# Altium project EEG_circuit.PrjPcb
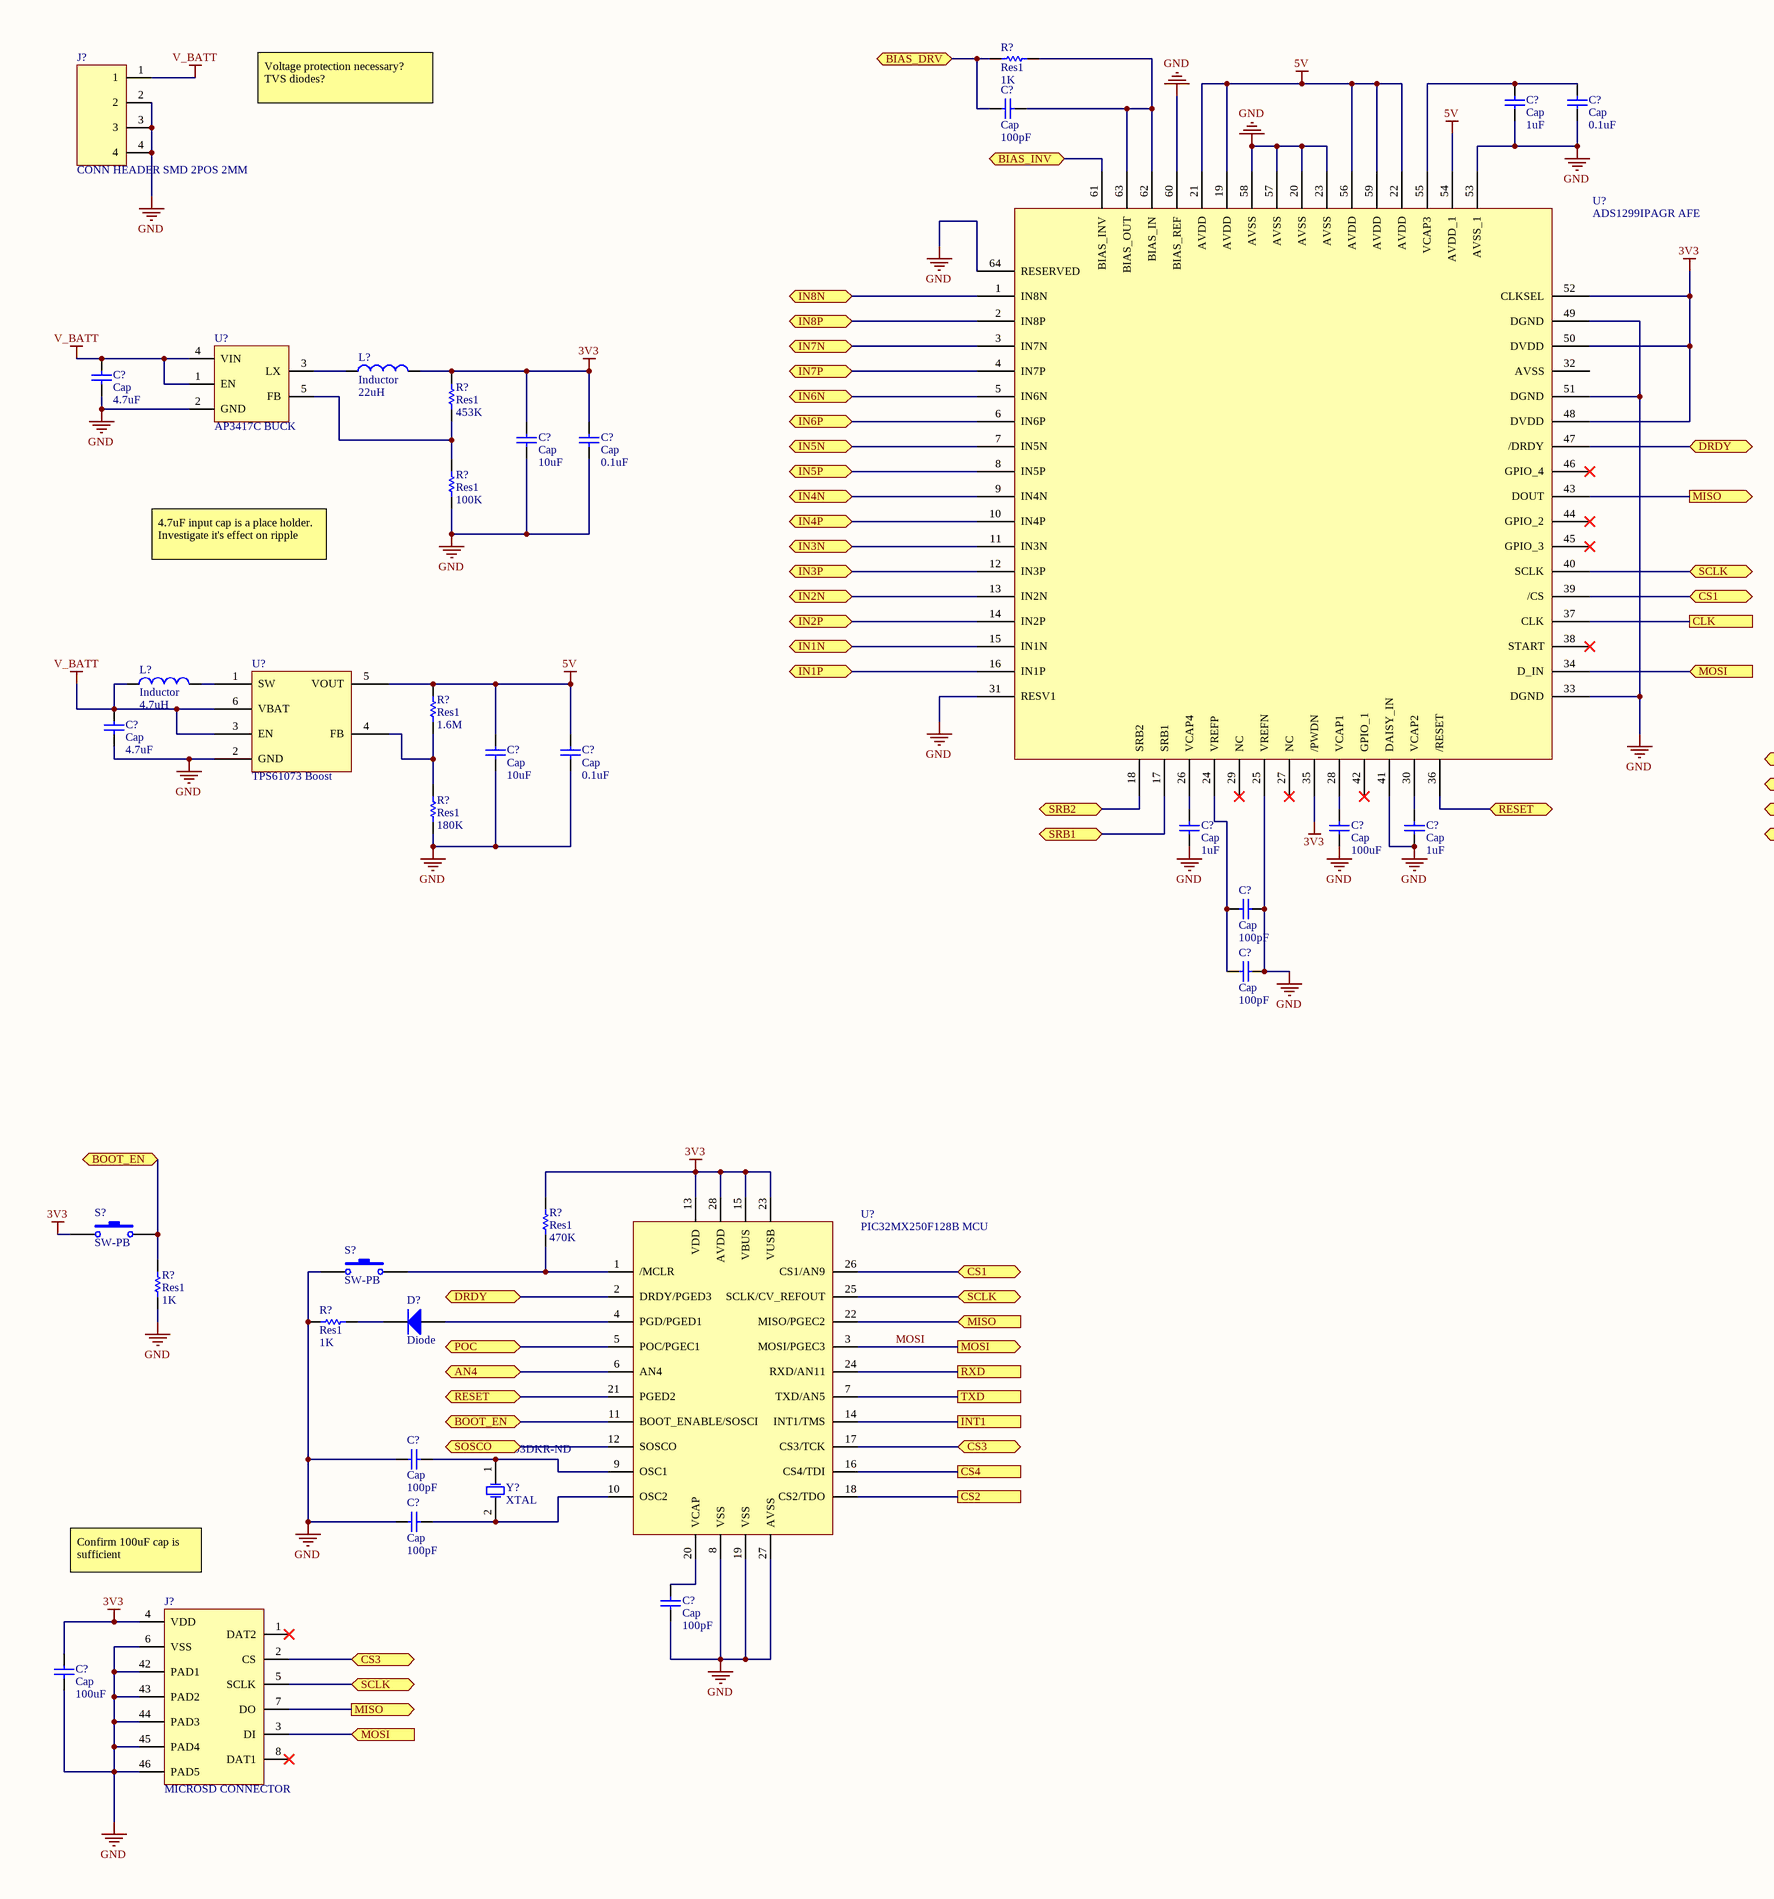
[diagram p0: EEG_schematic.SchDoc, left]
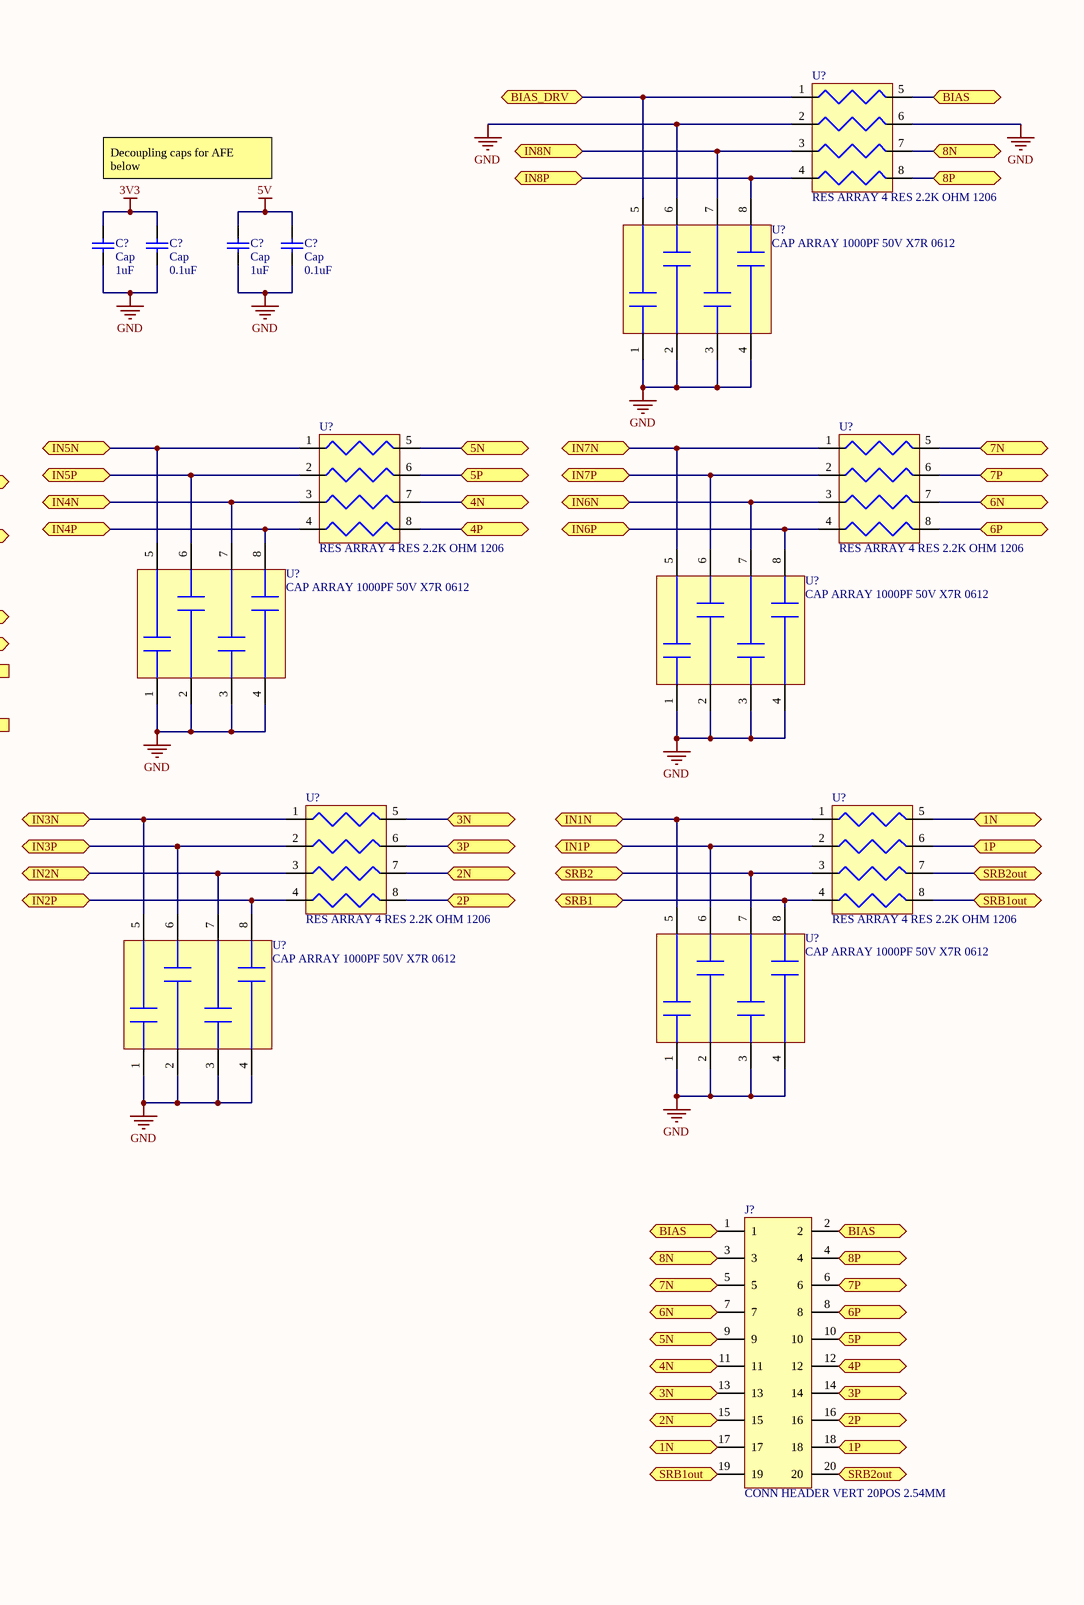
[diagram p1: EEG_schematic.SchDoc, right]
1 sheet, 53 parts. Net scope: flat (ports and power ports of the same name join across sheets).

## Sheet EEG_schematic.SchDoc
size A2

### Parts
(Parts that share a designator on the sheet are numbered #1, #2 ... from top to bottom, then left to right.)
C?#1  Cap  value 1uF  [RAD-0.3]
C?#2  Cap  value 0.1uF  [RAD-0.3]
C?#3  Cap  value 100pF  [RAD-0.3]
C?#4  Cap  value 1uF  [RAD-0.3]
C?#5  Cap  value 0.1uF  [RAD-0.3]
C?#6  Cap  value 1uF  [RAD-0.3]
C?#7  Cap  value 0.1uF  [RAD-0.3]
C?#8  Cap  value 4.7uF  [RAD-0.3]
C?#9  Cap  value 10uF  [RAD-0.3]
C?#10  Cap  value 0.1uF  [RAD-0.3]
C?#11  Cap  value 4.7uF  [RAD-0.3]
C?#12  Cap  value 10uF  [RAD-0.3]
C?#13  Cap  value 0.1uF  [RAD-0.3]
C?#14  Cap  value 1uF  [RAD-0.3]
C?#15  Cap  value 100uF  [RAD-0.3]
C?#16  Cap  value 1uF  [RAD-0.3]
C?#17  Cap  value 100pF  [RAD-0.3]
C?#18  Cap  value 100pF  [RAD-0.3]
C?#19  Cap  value 100pF  [RAD-0.3]
C?#20  Cap  value 100pF  [RAD-0.3]
C?#21  Cap  value 100pF  [RAD-0.3]
C?#22  Cap  value 100uF  [RAD-0.3]
D?  Diode  [SMC]
J?#1  CONN HEADER SMD 2POS 2MM
J?#2  CONN HEADER VERT 20POS 2.54MM
J?#3  MICROSD CONNECTOR
L?#1  Inductor  value 22uH  [0402-A]
L?#2  Inductor  value 4.7uH  [0402-A]
R?#1  Res1  value 1K  [AXIAL-0.3]
R?#2  Res1  value 453K
R?#3  Res1  value 100K
R?#4  Res1  value 1.6M
R?#5  Res1  value 180K
R?#6  Res1  value 470K  [AXIAL-0.3]
R?#7  Res1  value 1K  [AXIAL-0.3]
R?#8  Res1  value 1K  [AXIAL-0.3]
S?#1  SW-PB  [SPST-2]
S?#2  SW-PB  [SPST-2]
U?#1  RES ARRAY 4 RES 2.2K OHM 1206
U?#2  CAP ARRAY 1000PF 50V X7R 0612
U?#3  AP3417C BUCK
U?#4  RES ARRAY 4 RES 2.2K OHM 1206
U?#5  RES ARRAY 4 RES 2.2K OHM 1206
U?#6  ADS1299IPAGR AFE
U?#7  CAP ARRAY 1000PF 50V X7R 0612
U?#8  CAP ARRAY 1000PF 50V X7R 0612
U?#9  TPS61073 Boost
U?#10  RES ARRAY 4 RES 2.2K OHM 1206
U?#11  RES ARRAY 4 RES 2.2K OHM 1206
U?#12  CAP ARRAY 1000PF 50V X7R 0612
U?#13  CAP ARRAY 1000PF 50V X7R 0612
U?#14  PIC32MX250F128B MCU
Y?  XTAL  Supplier Part Number 1: XC2103DKR-ND

### Ports
1N (bidir), 1P (bidir), 2N (bidir), 2P (bidir), 3N (bidir), 3P (bidir), 4N (bidir), 4P (bidir), 5N (bidir), 5P (bidir), 6N (bidir), 6P (bidir), 7N (bidir), 7P (bidir), 8N (bidir), 8P (bidir), AN4 (bidir), BIAS (bidir), BIAS_DRV (bidir), BIAS_INV (bidir), BOOT_EN (bidir), CLK, CS1 (bidir), CS2, CS3 (bidir), CS4, DRDY (bidir), IN1N (bidir), IN1P (bidir), IN2N (bidir), IN2P (bidir), IN3N (bidir), IN3P (bidir), IN4N (bidir), IN4P (bidir), IN5N (bidir), IN5P (bidir), IN6N (bidir), IN6P (bidir), IN7N (bidir), IN7P (bidir), IN8N (bidir), IN8P (bidir), INT1, MISO (in), MISO (out), MOSI (in), MOSI (out), POC (bidir), RESET (bidir), RXD, SCLK (bidir), SOSCO (bidir), SRB1 (bidir), SRB1out (bidir), SRB2 (bidir), SRB2out (bidir), TXD

### Nets
3V3: C?#4.2 C?#5.2 C?#9.2 C?#10.2 C?#22.2 J?#3.4(VDD) L?#1.2 R?#2.2 R?#6.2 S?#1.1 U?#6.35(/PWDN) U?#6.48(DVDD) U?#6.50(DVDD) U?#6.52(CLKSEL) U?#14.13(VDD) U?#14.15(VBUS) U?#14.23(VUSB) U?#14.28(AVDD)
5V: C?#6.2 C?#7.2 C?#12.2 C?#13.2 R?#4.2 U?#6.19(AVDD) U?#6.21(AVDD) U?#6.22(AVDD) U?#6.54(AVDD_1) U?#6.56(AVDD) U?#6.59(AVDD) U?#9.5(VOUT)
GND: C?#1.1 C?#2.1 C?#4.1 C?#5.1 C?#6.1 C?#7.1 C?#8.1 C?#9.1 C?#10.1 C?#11.1 C?#12.1 C?#13.1 C?#14.1 C?#15.1 C?#16.1 C?#17.2 C?#18.2 C?#19.1 C?#20.1 C?#21.1 C?#22.1 J?#1.2 J?#1.3 J?#1.4 J?#3.6(VSS) J?#3.42(PAD1) J?#3.43(PAD2) J?#3.44(PAD3) J?#3.45(PAD4) J?#3.46(PAD5) R?#3.1 R?#5.1 R?#7.1 R?#8.1 S?#2.1 U?#1.2 U?#1.6 U?#2.1 U?#2.2 U?#2.3 U?#2.4 U?#2.6 U?#3.2(GND) U?#6.20(AVSS) U?#6.23(AVSS) U?#6.25(VREFN) U?#6.31(RESV1) U?#6.33(DGND) U?#6.41(DAISY_IN) U?#6.49(DGND) U?#6.51(DGND) U?#6.53(AVSS_1) U?#6.57(AVSS) U?#6.58(AVSS) U?#6.60(BIAS_REF) U?#6.64(RESERVED) U?#7.1 U?#7.2 U?#7.3 U?#7.4 U?#8.1 U?#8.2 U?#8.3 U?#8.4 U?#9.2(GND) U?#12.1 U?#12.2 U?#12.3 U?#12.4 U?#13.1 U?#13.2 U?#13.3 U?#13.4 U?#14.8(VSS) U?#14.19(VSS) U?#14.27(AVSS)
V_BATT: C?#8.2 C?#11.2 J?#1.1 L?#2.1 U?#3.1(EN) U?#3.4(VIN) U?#9.3(EN) U?#9.6(VBAT)
MOSI: J?#3.3(DI) U?#6.34(D_IN) U?#14.3(MOSI/PGEC3) ; port MOSI
NetC?#1_2: C?#1.2 C?#2.2 U?#6.55(VCAP3)
NetC?#3_1: C?#3.1 R?#1.2 U?#6.62(BIAS_IN) U?#6.63(BIAS_OUT)
NetC?#3_2: C?#3.2 R?#1.1 U?#1.1 U?#2.5 ; port BIAS_DRV
NetC?#14_2: C?#14.2 U?#6.26(VCAP4)
NetC?#15_2: C?#15.2 U?#6.28(VCAP1)
NetC?#16_2: C?#16.2 U?#6.30(VCAP2)
NetC?#17_1: C?#17.1 C?#18.1 U?#6.24(VREFP)
NetC?#19_2: C?#19.2 U?#14.9(OSC1) Y?.1(OSC1)
NetC?#20_2: C?#20.2 U?#14.10(OSC2) Y?.2(OSC2)
NetC?#21_2: C?#21.2 U?#14.20(VCAP)
NetD?_1: D?.1(A) U?#14.4(PGD/PGED1)
NetD?_2: D?.2(K) R?#8.2
NetJ?#2_1: J?#2.1 J?#2.2 U?#1.5 ; port BIAS
NetJ?#2_3: J?#2.3 U?#1.7 ; port 8N
NetJ?#2_4: J?#2.4 U?#1.8 ; port 8P
NetJ?#2_5: J?#2.5 U?#5.5 ; port 7N
NetJ?#2_6: J?#2.6 U?#5.6 ; port 7P
NetJ?#2_7: J?#2.7 U?#5.7 ; port 6N
NetJ?#2_8: J?#2.8 U?#5.8 ; port 6P
NetJ?#2_9: J?#2.9 U?#4.5 ; port 5N
NetJ?#2_10: J?#2.10 U?#4.6 ; port 5P
NetJ?#2_11: J?#2.11 U?#4.7 ; port 4N
NetJ?#2_12: J?#2.12 U?#4.8 ; port 4P
NetJ?#2_13: J?#2.13 U?#10.5 ; port 3N
NetJ?#2_14: J?#2.14 U?#10.6 ; port 3P
NetJ?#2_15: J?#2.15 U?#10.7 ; port 2N
NetJ?#2_16: J?#2.16 U?#10.8 ; port 2P
NetJ?#2_17: J?#2.17 U?#11.5 ; port 1N
NetJ?#2_18: J?#2.18 U?#11.6 ; port 1P
NetJ?#2_19: J?#2.19 U?#11.8 ; port SRB1out
NetJ?#2_20: J?#2.20 U?#11.7 ; port SRB2out
NetJ?#3_2: J?#3.2(CS) U?#14.17(CS3/TCK) ; port CS3
NetJ?#3_5: J?#3.5(SCLK) U?#6.40(SCLK) U?#14.25(SCLK/CV_REFOUT) ; port SCLK
NetJ?#3_7: J?#3.7(DO) U?#6.43(DOUT) U?#14.22(MISO/PGEC2) ; port MISO
NetL?#1_1: L?#1.1 U?#3.3(LX)
NetL?#2_2: L?#2.2 U?#9.1(SW)
NetR?#2_1: R?#2.1 R?#3.2 U?#3.5(FB)
NetR?#4_1: R?#4.1 R?#5.2 U?#9.4(FB)
NetR?#6_1: R?#6.1 S?#2.2 U?#14.1(/MCLR)
NetR?#7_2: R?#7.2 S?#1.2 U?#14.11(BOOT_ENABLE/SOSCI) ; port BOOT_EN
NetU?#1_3: U?#1.3 U?#2.7 U?#6.1(IN8N) ; port IN8N
NetU?#1_4: U?#1.4 U?#2.8 U?#6.2(IN8P) ; port IN8P
NetU?#4_1: U?#4.1 U?#6.7(IN5N) U?#7.5 ; port IN5N
NetU?#4_2: U?#4.2 U?#6.8(IN5P) U?#7.6 ; port IN5P
NetU?#4_3: U?#4.3 U?#6.9(IN4N) U?#7.7 ; port IN4N
NetU?#4_4: U?#4.4 U?#6.10(IN4P) U?#7.8 ; port IN4P
NetU?#5_1: U?#5.1 U?#6.3(IN7N) U?#8.5 ; port IN7N
NetU?#5_2: U?#5.2 U?#6.4(IN7P) U?#8.6 ; port IN7P
NetU?#5_3: U?#5.3 U?#6.5(IN6N) U?#8.7 ; port IN6N
NetU?#5_4: U?#5.4 U?#6.6(IN6P) U?#8.8 ; port IN6P
NetU?#6_11: U?#6.11(IN3N) U?#10.1 U?#13.5 ; port IN3N
NetU?#6_12: U?#6.12(IN3P) U?#10.2 U?#13.6 ; port IN3P
NetU?#6_13: U?#6.13(IN2N) U?#10.3 U?#13.7 ; port IN2N
NetU?#6_14: U?#6.14(IN2P) U?#10.4 U?#13.8 ; port IN2P
NetU?#6_15: U?#6.15(IN1N) U?#11.1 U?#12.5 ; port IN1N
NetU?#6_16: U?#6.16(IN1P) U?#11.2 U?#12.6 ; port IN1P
NetU?#6_17: U?#6.17(SRB1) U?#11.4 U?#12.8 ; port SRB1
NetU?#6_18: U?#6.18(SRB2) U?#11.3 U?#12.7 ; port SRB2
NetU?#6_36: U?#6.36(/RESET) U?#14.21(PGED2) ; port RESET
NetU?#6_37: U?#6.37(CLK) ; port CLK
NetU?#6_39: U?#6.39(/CS) U?#14.26(CS1/AN9) ; port CS1
NetU?#6_47: U?#6.47(/DRDY) U?#14.2(DRDY/PGED3) ; port DRDY
NetU?#6_61: U?#6.61(BIAS_INV) ; port BIAS_INV
NetU?#14_5: U?#14.5(POC/PGEC1) ; port POC
NetU?#14_6: U?#14.6(AN4) ; port AN4
NetU?#14_7: U?#14.7(TXD/AN5) ; port TXD
NetU?#14_12: U?#14.12(SOSCO) ; port SOSCO
NetU?#14_14: U?#14.14(INT1/TMS) ; port INT1
NetU?#14_16: U?#14.16(CS4/TDI) ; port CS4
NetU?#14_18: U?#14.18(CS2/TDO) ; port CS2
NetU?#14_24: U?#14.24(RXD/AN11) ; port RXD

Not connected (* = marked no-connect by the designer): J?#3 1(DAT2)* 8(DAT1)*; U?#6 27(NC)* 29(NC)* 32(AVSS) 38(START)* 42(GPIO_1)* 44(GPIO_2)* 45(GPIO_3)* 46(GPIO_4)*

### Notes on the sheet
- Voltage protection necessary? TVS diodes?
- Decoupling caps for AFE below
- 4.7uF input cap is a place holder. Investigate it's effect on ripple
- Confirm 100uF cap is sufficient

### Library data of the parts
C?#1-C?#22 = Cap: Capacitor; Published: 8-Jun-2000; LatestRevisionDate: 17-Jul-2002; LatestRevisionNote: Re-released for DXP Platform.; PackageReference: RAD-0.3; Publisher: Altium Limited; PackageDescription: Radial Cap, Thru-Hole; 2 Leads; 0.3 in Pin Spacing
D? = Diode: Default Diode; Published: 8-Jun-2000; LatestRevisionDate: 17-Jul-2002; LatestRevisionNote: Re-released for DXP Platform.; PackageVersion: Sep-1996; PackageReference: SMC; Publisher: Altium Limited; PackageDescription: DO-214-AB/SMC; 2 C-Bend Leads; Body 7.9 x 5.9 mm, inc. leads (LxW); Code_JEDEC: DO-214-AB
J?#1 = B2B-PH-SM4-TBT(LF)(SN): Manufacturer: JST; Number of Positions: 2; Connector Type: Male Pin; Pitch: 0.079inch; Supplier 1: Digi-Key; Manufacturer Part Number: B2B-PH-SM4-TBT(LF)(SN); Stock 1: 6672; Pricing 1: 1=0.82, 10=0.768, 100=0.5888, 500=0.51202 (USD); Mount: Surface Mount; Color: Natural; Contact Plating: Tin; Packaging: Cut Tape; Number of Rows: 1; Package Quantity: 1; Fastening Type: Detent; Termination: Solder; Contact Mating Length: 0.13inch; Lead Free: Lead Free; ComponentLink1URL: https://www.verical.com/server-webapp/html/getDatasheet?partID=473167&src-supplier=Verical; ComponentLink1Description: https://www.verical.com/server-webapp/html/getDatasheet?partID=473167&src-supplier=Verical; ComponentLink2URL: http://www.jst-mfg.com/product/pdf/eng/ePH.pdf?src-supplier=Digi-Key; ComponentLink2Description: http://www.jst-mfg.com/product/pdf/eng/ePH.pdf?src-supplier=Digi-Key; Supplier Part Number 1: 455-2872-6-ND
J?#2 = 61302021121: WURTH ELEKTRONIK         61302021121            Board-To-Board Connector, Vertical, WR-PHD Series, Through Hole, Header, 20 Contacts, 2.54 mm; Manufacturer: Wurth Electronics; Number of Positions: 20; Gender: Male; Connector Type: Male Pin; Pitch: 0.1inch; Supplier 1: Digi-Key; Manufacturer Part Number: 61302021121; Stock 1: 1836; Pricing 1: 1=1.31, 10=1.115, 25=0.9292, 50=0.774, 100=0.704, 500=0.64 (USD); Mount: Through Hole; Contact Plating: Gold; Contact Material: Copper; Color: Black; Number of Rows: 2; Packaging: Bulk; Termination: Solder; Number of Contacts: 20; Row Spacing: 0.1inch; Contact Mating Length: 0.236inch; REACH SVHC: Unknown; ComponentLink1URL: http://www.farnell.com/datasheets/1442180.pdf?src-supplier=Element14; ComponentLink1Description: http://www.farnell.com/datasheets/1442180.pdf?src-supplier=Element14; Supplier Part Number 1: 732-5301-ND
J?#3 = MEM2067-02-180-00-A: GLOBAL CONNECTOR TECHNOLOGY         MEM2067-02-180-00-A             MEMORY CARD CONNECTOR, 8 POSITION; Number of Contacts: 8; Supplier 1: Digi-Key; Manufacturer: Global Connector Technology; Manufacturer Part Number: MEM2067-02-180-00-A; Stock 1: 0; Mount: Socket; Contact Material: Copper Alloy; Contact Plating: Gold; REACH SVHC: No SVHC; Lead Free: Lead Free; ComponentLink1URL: http://www.farnell.com/datasheets/1876941.pdf?src-supplier=Element14; ComponentLink1Description: http://www.farnell.com/datasheets/1876941.pdf?src-supplier=Element14; ComponentLink2URL: http://www.farnell.com/datasheets/1876941.pdf?src-supplier=Farnell; ComponentLink2Description: http://www.farnell.com/datasheets/1876941.pdf?src-supplier=Farnell; Supplier Part Number 1: 2073-MEM2067-02-180-00-ACT-ND
L?#1 L?#2 = Inductor: Code_IEC: 1005; Published: 8-Jun-2000; LatestRevisionDate: 29-May-2009; LatestRevisionNote: IPC-7351 Footprint Added.; PackageReference: 0402-A; Publisher: Altium Limited; PackageDescription: Chip Inductor; Code_JEITA: 0402
R?#1 R?#6-R?#8 = Res1: Resistor; Published: 8-Jun-2000; LatestRevisionDate: 17-Jul-2002; LatestRevisionNote: Re-released for DXP Platform.; PackageReference: AXIAL-0.3; Publisher: Altium Limited; PackageDescription: Axial Device, Thru-Hole; 2 Leads; 0.3 in Pin Spacing
R?#2 = Res1: Resistor; Manufacturer: Yageo; Manufacturer Part Number: RC0402FR-07453KL; Description: Thick Film Resistors - SMD 453K OHM 1%; Resistance: 453kR; Tolerance: 1%; Power Rating: 62.5mW; Voltage Rating: 50V; Max Power Dissipation: 63mW; Temperature Coefficient: 100ppm/°C; Published: 8-Jun-2000; LatestRevisionDate: 17-Jul-2002; LatestRevisionNote: Re-released for DXP Platform.; PackageReference: AXIAL-0.3; Publisher: Altium Limited; PackageDescription: Axial Device, Thru-Hole; 2 Leads; 0.3 in Pin Spacing; Supplier 1: Digi-Key; Supplier Part Number 1: YAG3164DKR-ND; Stock 1: 786377; Pricing 1: 1=0.1, 10=0.016, 100=0.0064, 1000=0.00289, 2500=0.00251, 5000=0.00207 (USD); Case/Package: 0402; Case Code (Imperial): 0402; Case Code (Metric): 1005; Contact Plating: Tin,Matte; Min Operating Temperature: -55°C; Max Operating Temperature: 155°C; Packaging: Tape and Reel; Composition: Thick Film; Number of Terminations: 2; Termination: SMD/SMT; Military Standard: Not; Voltage Rating (DC): 50V; Features: Moisture Resistant; Length: 1mm; Height: 0.016inch; Width: 0.02inch; Depth: 0.5mm; Lead Free: Lead Free; ComponentLink1URL: http://www.yageo.com/documents/recent/PYu-RC0402_51_RoHS_L_6_r.pdf?src-supplier=Future+Electronics; ComponentLink1Description: http://www.yageo.com/documents/recent/PYu-RC0402_51_RoHS_L_6_r.pdf?src-supplier=Future+Electronics; ComponentLink2URL: https://www.verical.com/server-webapp/html/getDatasheet?partID=325135&src-supplier=Verical; ComponentLink2Description: https://www.verical.com/server-webapp/html/getDatasheet?partID=325135&src-supplier=Verical; ComponentLink3URL: http://www.yageo.com/documents/recent/PYu-RC0402_51_RoHS_L_6.pdf?src-supplier=Avnet; ComponentLink3Description: http://www.yageo.com/documents/recent/PYu-RC0402_51_RoHS_L_6.pdf?src-supplier=Avnet; ComponentLink4URL: http://www.yageo.com/documents/recent/PYu-RC0402_51_RoHS_L_6.pdf?src-supplier=Avnet+Europe; ComponentLink4Description: http://www.yageo.com/documents/recent/PYu-RC0402_51_RoHS_L_6.pdf?src-supplier=Avnet+Europe
R?#3 = Res1: Resistor; Manufacturer: Yageo; Manufacturer Part Number: RC0402FR-07100KL; Description: RES SMD 100K OHM 1% 1/16W 0402; Tolerance: 1%; Resistance: 100kR; Temperature Coefficient: 100ppm/°C; Power Rating: 63mW; Voltage Rating: 50V; Published: 8-Jun-2000; LatestRevisionDate: 17-Jul-2002; LatestRevisionNote: Re-released for DXP Platform.; PackageReference: AXIAL-0.3; Publisher: Altium Limited; PackageDescription: Axial Device, Thru-Hole; 2 Leads; 0.3 in Pin Spacing; Supplier 1: Digi-Key; Supplier Part Number 1: 311-100KLRDKR-ND; Stock 1: 56936694; Pricing 1: 1=0.1, 10=0.015, 100=0.006, 1000=0.0027, 2500=0.00235, 5000=0.00194 (USD); Case/Package: 0402; Case Code (Metric): 1005; Case Code (Imperial): 0402; Min Operating Temperature: -55°C; Max Operating Temperature: 155°C; Packaging: Tape and Reel; Composition: Thick Film; Termination: SMD/SMT; Military Standard: Not; Number of Terminations: 2; Working Voltage: 50V; Package Quantity: 1; Max Power Dissipation: 63mW; Features: Moisture Resistant; Length: 0.039inch; Height: 0.016inch; Width: 0.02inch; Depth: 0.5mm; REACH SVHC: No SVHC; Lead Free: Lead Free; ComponentLink1URL: http://www.yageo.com/documents/recent/PYu-RC_Group_51_RoHS_L_10.pdf?src-supplier=Digi-Key; ComponentLink1Description: http://www.yageo.com/documents/recent/PYu-RC_Group_51_RoHS_L_10.pdf?src-supplier=Digi-Key; ComponentLink2URL: http://www.farnell.com/datasheets/1018594.pdf?src-supplier=Element14; ComponentLink2Description: http://www.farnell.com/datasheets/1018594.pdf?src-supplier=Element14; ComponentLink3URL: http://www.yageo.com/documents/recent/PYu-RC_Group_51_RoHS_L_9.pdf?src-supplier=Verical; ComponentLink3Description: http://www.yageo.com/documents/recent/PYu-RC_Group_51_RoHS_L_9.pdf?src-supplier=Verical; ComponentLink4URL: http://www.yageo.com/documents/recent/PYu-RC_Group_51_RoHS_L_9.pdf?src-supplier=Mouser; ComponentLink4Description: http://www.yageo.com/documents/recent/PYu-RC_Group_51_RoHS_L_9.pdf?src-supplier=Mouser; ComponentLink5URL: http://documents.rs-components.com/techlib://itc_doclist_GB.htm?stockno=6185797&src-supplier=RSComponents; ComponentLink5Description: http://documents.rs-components.com/techlib://itc_doclist_GB.htm?stockno=6185797&src-supplier=RSComponents
R?#4 = Res1: Resistor; Manufacturer: Yageo; Manufacturer Part Number: RC0402JR-071M6L; Description: Res Thick Film 0402 1.6M Ohm 5% 0.063W(1/16W) ±100ppm/C Molded SMD Paper T/R; Resistance: 1.6MR; Tolerance: 5%; Max Power Dissipation: 63mW; Temperature Coefficient: 100ppm/°C; Published: 8-Jun-2000; LatestRevisionDate: 17-Jul-2002; LatestRevisionNote: Re-released for DXP Platform.; PackageReference: AXIAL-0.3; Publisher: Altium Limited; PackageDescription: Axial Device, Thru-Hole; 2 Leads; 0.3 in Pin Spacing; Supplier 1: Digi-Key; Supplier Part Number 1: YAG3284DKR-ND; Stock 1: 21969; Pricing 1: 1=0.1, 10=0.013, 100=0.0053, 1000=0.00236, 2500=0.00205, 5000=0.00169 (USD); Case/Package: 0402; Case Code (Metric): 1005; Case Code (Imperial): 0402; Contact Plating: Tin,Matte; Min Operating Temperature: -55°C; Max Operating Temperature: 155°C; Packaging: Tape and Reel; Composition: Thick Film; Number of Terminations: 2; Military Standard: Not; Features: Moisture Resistant; Length: 0.039inch; Height: 0.016inch; Width: 0.02inch; Depth: 0.5mm; Radiation Hardening: No; ComponentLink1URL: http://www.yageo.com/documents/recent/PYu-RC0402_51_RoHS_L_6.pdf?src-supplier=Avnet; ComponentLink1Description: http://www.yageo.com/documents/recent/PYu-RC0402_51_RoHS_L_6.pdf?src-supplier=Avnet; ComponentLink2URL: http://www.yageo.com/documents/recent/PYu-RC0402_51_RoHS_L_6.pdf?src-supplier=Avnet+Europe; ComponentLink2Description: http://www.yageo.com/documents/recent/PYu-RC0402_51_RoHS_L_6.pdf?src-supplier=Avnet+Europe
R?#5 = Res1: Resistor; Manufacturer: Yageo; Manufacturer Part Number: RC0402JR-07180KL; Description: RES SMD 180K OHM 5% 1/16W 0402; Resistance: 180kR; Tolerance: 5%; Power Rating: 63mW; Voltage Rating: 50V; Temperature Coefficient: 100ppm/°C; Published: 8-Jun-2000; LatestRevisionDate: 17-Jul-2002; LatestRevisionNote: Re-released for DXP Platform.; PackageReference: AXIAL-0.3; Publisher: Altium Limited; PackageDescription: Axial Device, Thru-Hole; 2 Leads; 0.3 in Pin Spacing; Supplier 1: Digi-Key; Supplier Part Number 1: 311-180KJRDKR-ND; Stock 1: 249583; Pricing 1: 1=0.1, 10=0.013, 100=0.0053, 1000=0.00236, 2500=0.00205, 5000=0.00169 (USD); Case/Package: 0402; Number of Pins: 2; Case Code (Imperial): 0402; Case Code (Metric): 1005; Min Operating Temperature: -55°C; Max Operating Temperature: 155°C; Voltage Rating (DC): 50V; Packaging: Tape and Reel; Package Quantity: 1; Termination: SMD/SMT; Composition: Thick Film; Number of Terminations: 2; Military Standard: Not; Max Power Dissipation: 63mW; Features: Moisture Resistant; Length: 1mm; Height: 0.016inch; Width: 0.5mm; Depth: 0.5mm; REACH SVHC: Unknown; Lead Free: Lead Free; ComponentLink1URL: http://www.farnell.com/datasheets/1018594.pdf?src-supplier=Farnell; ComponentLink1Description: http://www.farnell.com/datasheets/1018594.pdf?src-supplier=Farnell; ComponentLink2URL: http://www.yageo.com/documents/recent/PYu-RC0402_51_RoHS_L_6_r.pdf?src-supplier=Future+Electronics; ComponentLink2Description: http://www.yageo.com/documents/recent/PYu-RC0402_51_RoHS_L_6_r.pdf?src-supplier=Future+Electronics; ComponentLink3URL: http://www.farnell.com/datasheets/1018594.pdf?src-supplier=Element14; ComponentLink3Description: http://www.farnell.com/datasheets/1018594.pdf?src-supplier=Element14; ComponentLink4URL: http://www.yageo.com/documents/recent/PYu-RC_Group_51_RoHS_L_9.pdf?src-supplier=Digi-Key; ComponentLink4Description: http://www.yageo.com/documents/recent/PYu-RC_Group_51_RoHS_L_9.pdf?src-supplier=Digi-Key; ComponentLink5URL: http://www.yageo.com.tw/exep/pages/download/literatures/PYu-R_INT-thick_7.pdf?src-supplier=Digi-Key; ComponentLink5Description: http://www.yageo.com.tw/exep/pages/download/literatures/PYu-R_INT-thick_7.pdf?src-supplier=Digi-Key
S?#1 S?#2 = SW-PB: Switch; Published: 24-Mar-1999; LatestRevisionDate: 17-Jul-2002; LatestRevisionNote: Re-released for DXP Platform.; PackageReference: SPST-2; Publisher: Altium Limited; PackageDescription: Switch; 2 Leads
U?#1 U?#4 U?#5 U?#10 U?#11 = CAY16-2201F4LF: BOURNS         CAY16-2201F4LF             RESISTOR, ARRAY-4, 2.2KOHM, 5%, SMD; Resistance: 2.2kR; Tolerance: 1%; Power Rating: 248mW; Voltage Rating: 50V; Number of Elements: 4; Circuit Type: Isolated; Power Per Element: 62.5mW; Temperature Coefficient: 200ppm/°C; Supplier 1: Digi-Key; Manufacturer: Bourns; Manufacturer Part Number: CAY16-2201F4LF; Stock 1: 16204; Pricing 1: 1=0.14, 10=0.121, 25=0.088, 50=0.0638, 100=0.0473, 250=0.03632, 500=0.0286, 1000=0.0198 (USD); Mount: Surface Mount; Case/Package: 1206; Number of Pins: 8; Case Code (Metric): 3216; Case Code (Imperial): 1206; Number of Terminals: 8; Contact Plating: Tin; Min Operating Temperature: -55°C; Max Operating Temperature: 125°C; Packaging: Tape and Reel; Package Quantity: 1; Number of Resistors: 4; Termination: Convex; Military Standard: Not; Voltage Rating (DC): 50V; Number of Circuits: 4; Length: 3.2mm; Height: 0.024inch; Width: 0.063inch; Lead Pitch: 0.8mm; Terminal Pitch: 0.8mm; Depth: 1.6mm; REACH SVHC: No SVHC; Lead Free: Lead Free; ComponentLink1URL: http://uk.rs-online.com/webdocs/064e/0900766b8064e462.pdf?src-supplier=RSComponents; ComponentLink1Description: http://uk.rs-online.com/webdocs/064e/0900766b8064e462.pdf?src-supplier=RSComponents; ComponentLink2URL: http://www.bourns.com/pdfs/CATCAY.pdf?src-supplier=Avnet+Europe; ComponentLink2Description: http://www.bourns.com/pdfs/CATCAY.pdf?src-supplier=Avnet+Europe; ComponentLink3URL: http://www.bourns.com/docs/Product-Datasheets/CATCAY.pdf?src-supplier=Digi-Key; ComponentLink3Description: http://www.bourns.com/docs/Product-Datasheets/CATCAY.pdf?src-supplier=Digi-Key; ComponentLink4URL: http://www.bourns.com/pdfs/CATCAY.pdf?src-supplier=Avnet; ComponentLink4Description: http://www.bourns.com/pdfs/CATCAY.pdf?src-supplier=Avnet; ComponentLink5URL: http://www.farnell.com/datasheets/1849489.pdf?src-supplier=Element14; ComponentLink5Description: http://www.farnell.com/datasheets/1849489.pdf?src-supplier=Element14; ComponentLink6URL: https://www.bourns.com/docs/Product-Datasheets/CATCAY.pdf?src-supplier=Digi-Key; ComponentLink6Description: https://www.bourns.com/docs/Product-Datasheets/CATCAY.pdf?src-supplier=Digi-Key; ComponentLink7URL: http://www.produktinfo.conrad.com/datenblaetter/1000000-1099999/001055385-da-01-en-WID_ARR_CAY16_2201F4LF_2_2K_OHM_4_W_1206.pdf?src-supplier=Conrad; ComponentLink7Description: http://www.produktinfo.conrad.com/datenblaetter/1000000-1099999/001055385-da-01-en-WID_ARR_CAY16_2201F4LF_2_2K_OHM_4_W_1206.pdf?src-supplier=Conrad; Supplier Part Number 1: CAY16-2201F4LFDKR-ND
U?#2 U?#7 U?#8 U?#12 U?#13 = CA0612KRX7R9BB102: YAGEO (PHYCOMP)         CA0612KRX7R9BB102             Capacitor Array, C-Array, 1000 pF, 50 V,  10%, SMD, 4 Element; Dielectric Material: Ceramic; Capacitance: 1nF; Number of Elements: 4; Circuit Type: Isolated; Dissipation Factor: 2.5%; Insulation Resistance: 10GR; Supplier 1: Digi-Key; Manufacturer: Yageo; Manufacturer Part Number: CA0612KRX7R9BB102; Stock 1: 2369; Pricing 1: 1=0.41, 10=0.283, 100=0.1697, 500=0.12728, 1000=0.10749 (USD); Mount: Surface Mount; Case/Package: 0612; Case Code (Metric): 1632; Case Code (Imperial): 0612; Number of Terminals: 8; Min Operating Temperature: -55°C; Max Operating Temperature: 125°C; Tolerance: 10%; Voltage Rating: 50V; Packaging: Tape and Reel; Package Quantity: 4000; Dielectric: X7R; Number of Capacitors: 4; Termination: SMD/SMT; Composition: Ceramic; Voltage: 50V; Length: 3.2mm; Height: 0.8mm; Width: 0.063inch; Height - Seated (Max): 0.035inch; Terminal Pitch: 0.8mm; Depth: 3.2mm; Radiation Hardening: No; REACH SVHC: Unknown; Lead Free: Lead Free; ComponentLink1URL: https://www.verical.com/server-webapp/html/getDatasheet?partID=403419&src-supplier=Verical; ComponentLink1Description: https://www.verical.com/server-webapp/html/getDatasheet?partID=403419&src-supplier=Verical; ComponentLink2URL: http://www.yageo.com/documents/recent/UPY-4C-Array_16V-to-50V-3.pdf?src-supplier=Digi-Key; ComponentLink2Description: http://www.yageo.com/documents/recent/UPY-4C-Array_16V-to-50V-3.pdf?src-supplier=Digi-Key; ComponentLink3URL: http://www.farnell.com/datasheets/2167451.pdf?src-supplier=Element14; ComponentLink3Description: http://www.farnell.com/datasheets/2167451.pdf?src-supplier=Element14; ComponentLink4URL: http://www.yageo.com/documents/recent/UPY-4C-Array_16V-to-50V_4.pdf?src-supplier=Future+Electronics; ComponentLink4Description: http://www.yageo.com/documents/recent/UPY-4C-Array_16V-to-50V_4.pdf?src-supplier=Future+Electronics; Supplier Part Number 1: 311-2073-6-ND
U?#3 = AP3417CKTR-G1: IC REG BUCK ADJ 1A SYNC SOT25; Manufacturer: Diodes; Number of Outputs: 1; Min Input Voltage: 2.5V; Max Input Voltage: 5.5V; Efficiency: 94%; Min Output Voltage: 600mV; Max Output Voltage: 4.95V; Switching Frequency: 1.5MHz; Synchronous Rectifier: Yes; Output Voltage: 5V; Operating Supply Current: 220uA; Output Type: Adjustable; Output Configuration: Positive; Supplier 1: Digi-Key; Manufacturer Part Number: AP3417CKTR-G1; Stock 1: 30373; Pricing 1: 1=0.41, 10=0.351, 100=0.2621, 500=0.20592, 1000=0.15912 (USD); Mount: Surface Mount; Case/Package: SOT-23-5; Number of Pins: 5; Weight: 0.001058oz; Min Operating Temperature: -40°C; Max Operating Temperature: 85°C; Package Quantity: 3000; Packaging: Tape and Reel; Max Output Current: 1A; Output Current: 1A; Min Supply Voltage: 2.5V; Operating Supply Voltage: 5.5V; Length: 3.1mm; Height: 1.3mm; Width: 1.7mm; Lead Free: Lead Free; ComponentLink1URL: https://www.diodes.com/assets/Datasheets/AP3417C.pdf?src-supplier=Digi-Key; ComponentLink1Description: https://www.diodes.com/assets/Datasheets/AP3417C.pdf?src-supplier=Digi-Key; ComponentLink2URL: http://www.diodes.com/datasheets/AP3417C.pdf?src-supplier=Avnet; ComponentLink2Description: http://www.diodes.com/datasheets/AP3417C.pdf?src-supplier=Avnet; Supplier Part Number 1: AP3417CKTR-G1DIDKR-ND
U?#6 = ADS1299IPAGR: IC AFE 24BIT 16KSPS LN 64TQFP; Manufacturer: Texas Instruments; Max Supply Voltage: 5.25V; Max Power Dissipation: 42mW; Interface: SPI; Number of Bits: 24; Number of Channels: 8; Resolution: 24b; Sampling Rate: 16KS/s; Operating Supply Current: 7.14mA; Signal to Noise Ratio (SNR): 121dB; Power Consumption: 41mW; Supplier 1: Digi-Key; Manufacturer Part Number: ADS1299IPAGR; Stock 1: 1589; Pricing 1: 1=53.84, 10=50.577, 100=44.051 (USD); Case/Package: TQFP; Number of Pins: 64; Contact Plating: Gold; Min Operating Temperature: -40°C; Max Operating Temperature: 85°C; Package Quantity: 1; Packaging: Tape and Reel; Number of Converters: 8; Conversion Rate: 16KS/s; Number of Inputs: 8; Number of A/D Converters: 8; Type: General Purpose; Radiation Hardening: No; Lead Free: Lead Free; ComponentLink1URL: http://www.ti.com/lit/ds/symlink/ads1299.pdf?src-supplier=Digi-Key; ComponentLink1Description: http://www.ti.com/lit/ds/symlink/ads1299.pdf?src-supplier=Digi-Key; ComponentLink2URL: http://www.ti.com/general/docs/lit/getliterature.tsp?genericPartNumber=ADS1299&&fileType=pdf&src-supplier=Avnet; ComponentLink2Description: http://www.ti.com/general/docs/lit/getliterature.tsp?genericPartNumber=ADS1299&&fileType=pdf&src-supplier=Avnet; ComponentLink3URL: https://www.verical.com/server-webapp/html/getDatasheet?partID=681922&src-supplier=Verical; ComponentLink3Description: https://www.verical.com/server-webapp/html/getDatasheet?partID=681922&src-supplier=Verical; ComponentLink4URL: http://www.ti.com/litv/sbas499a?src-supplier=Mouser; ComponentLink4Description: http://www.ti.com/litv/sbas499a?src-supplier=Mouser; ComponentLink5URL: http://www.produktinfo.conrad.com/datenblaetter/1100000-1199999/001186463-da-01-en-IC_AFE_24BIT_16_ADS1299IPAGR_TQFP_64_TID.pdf?src-supplier=Conrad; ComponentLink5Description: http://www.produktinfo.conrad.com/datenblaetter/1100000-1199999/001186463-da-01-en-IC_AFE_24BIT_16_ADS1299IPAGR_TQFP_64_TID.pdf?src-supplier=Conrad; Supplier Part Number 1: 296-34818-6-ND; Category: Data Acquisition - Analog Front End (AFE)
U?#9 = TPS61073DDCR: IC REG BOOST ADJ 0.5A SYNC SOT6; Manufacturer: Texas Instruments; Output Voltage: 5.5V; Number of Outputs: 1; Max Output Current: 150mA; Min Input Voltage: 900mV; Efficiency: 90%; Frequency: 1.2MHz; Min Supply Voltage: 2.3V; Synchronous Rectifier: Yes; Quiescent Current: 19uA; Output Type: Adjustable; Output Configuration: Positive; Supplier 1: Digi-Key; Manufacturer Part Number: TPS61073DDCR; Stock 1: 6000; Pricing 1: 3000=0.52668, 6000=0.50688, 15000=0.49104 (USD); Mount: Surface Mount; Case/Package: SOT-23-6; Number of Pins: 6; Weight: 0.00127oz; Min Operating Temperature: -40°C; Max Operating Temperature: 85°C; Packaging: Tape and Reel; Max Input Voltage: 5.5V; Output Current: 150mA; Max Supply Voltage: 5.5V; Package Quantity: 1; Switching Frequency: 1.2MHz; Min Output Voltage: 2.3V; Max Output Voltage: 5.5V; Termination: SMD/SMT; Topology: Boost; REACH SVHC: No SVHC; Lead Free: Lead Free; ComponentLink1URL: http://focus.ti.com/lit/ds/symlink/tps61070.pdf?src-supplier=Element14; ComponentLink1Description: http://focus.ti.com/lit/ds/symlink/tps61070.pdf?src-supplier=Element14; ComponentLink2URL: http://www.ti.com/lit/ds/symlink/tps61073.pdf?src-supplier=Digi-Key; ComponentLink2Description: http://www.ti.com/lit/ds/symlink/tps61073.pdf?src-supplier=Digi-Key; Supplier Part Number 1: 296-21898-2-ND; Category: PMIC - Voltage Regulators - DC DC Switching Regulators
U?#14 = PIC32MX250F128B-I/SS: MICROCHIP - PIC32MX250F128B-I/SS - MCU, 32BIT, PIC32, 40MHZ, SSOP-28; Number of Timers/Counters: 5; Number of ADC Channels: 10; RAM Size: 32KB; Interface: I2C,SPI,USB,IrDA,UART,USART,LIN,I2S; Number of I/Os: 19; Max Supply Voltage: 3.6V; Min Supply Voltage: 2.3V; Number of UART Channels: 2; Data Bus Width: 32b; Oscillator Type: Internal; Watchdog Timer: Yes; Memory Type: FLASH; Memory Size: 128KB; Peripherals: I2C,Brown-out Detect/Reset,POR,PWM,WDT,DMA; Core Architecture: PIC; Supplier 1: Digi-Key; Manufacturer: Microchip; Manufacturer Part Number: PIC32MX250F128B-I/SS; Stock 1: 861; Pricing 1: 1=3.57, 25=3.27, 100=2.96 (USD); Case/Package: SSOP; Number of Pins: 28; Min Operating Temperature: -40°C; Max Operating Temperature: 85°C; Packaging: Rail/Tube; Package Quantity: 47; Frequency: 40MHz; Number of PWM Channels: 5; Number of Programmable I/O: 19; Max Frequency: 40MHz; Number of SPI Channels: 2; Number of I2C Channels: 2; Address Bus Width: 32b; Length: 10.5mm; Height: 1.85mm; Width: 5.6mm; Radiation Hardening: No; REACH SVHC: No SVHC; Lead Free: Lead Free; ComponentLink1URL: https://www.distrelec.biz/Web/Downloads/_t/ds/PIC32MX1XX_2XX_eng_tds.pdf?mime=application%2Fpdf&src-supplier=Distrelec; ComponentLink1Description: https://www.distrelec.biz/Web/Downloads/_t/ds/PIC32MX1XX_2XX_eng_tds.pdf?mime=application%2Fpdf&src-supplier=Distrelec; ComponentLink2URL: http://uk.rs-online.com/webdocs/1385/0900766b8138557c.pdf?src-supplier=RSComponents; ComponentLink2Description: http://uk.rs-online.com/webdocs/1385/0900766b8138557c.pdf?src-supplier=RSComponents; ComponentLink3URL: http://www.microchip.com/mymicrochip/filehandler.aspx?ddocname=en556114&src-supplier=Digi-Key; ComponentLink3Description: http://www.microchip.com/mymicrochip/filehandler.aspx?ddocname=en556114&src-supplier=Digi-Key; ComponentLink4URL: http://ww1.microchip.com/downloads/en/DeviceDoc/61168D.pdf?src-supplier=Avnet; ComponentLink4Description: http://ww1.microchip.com/downloads/en/DeviceDoc/61168D.pdf?src-supplier=Avnet; ComponentLink5URL: http://www.farnell.com/datasheets/1538023.pdf?src-supplier=Element14; ComponentLink5Description: http://www.farnell.com/datasheets/1538023.pdf?src-supplier=Element14; Supplier Part Number 1: PIC32MX250F128B-I/SS-ND
Y? = XTAL: Crystal Oscillator; Manufacturer: ECS International; Manufacturer Part Number: ECS-80-18-30-JGN-TR; Description: CRYSTAL 8.000 MHZ 18PF SMD; Frequency: 8MHz; Load Capacitance: 18pF; ESR (Equivalent Series Resistance): 100R; Frequency Stability: 30ppm; Frequency Tolerance: 20ppm; Published: 8-Jun-2000; LatestRevisionDate: 17-Jul-2002; LatestRevisionNote: Re-released for DXP Platform.; PackageReference: R38; Publisher: Altium Limited; PackageDescription: Crystal, Thru-Hole; 2 Leads; Body 3.1 x 8.2 mm (Dia.xH); Supplier 1: Digi-Key; Stock 1: 5339; Pricing 1: 1=0.69, 10=0.607, 50=0.5676, 100=0.5016, 500=0.4752 (USD); Mount: Surface Mount; Case/Package: SMD/SMT; Min Operating Temperature: -40°C; Max Operating Temperature: 85°C; Packaging: Tape and Reel; Length: 0.197inch; Height: 0.055inch; Width: 0.126inch; ComponentLink1URL: http://www.mouser.com/ds/2/122/ecx-53r-17605.pdf?src-supplier=Mouser; ComponentLink1Description: http://www.mouser.com/ds/2/122/ecx-53r-17605.pdf?src-supplier=Mouser; ComponentLink2URL: http://www.ecsxtal.com/store/pdf/partnumber4.pdf?src-supplier=Digi-Key; ComponentLink2Description: http://www.ecsxtal.com/store/pdf/partnumber4.pdf?src-supplier=Digi-Key; ComponentLink3URL: http://www.ecsxtal.com/store/pdf/ecx-53r.pdf?src-supplier=Digi-Key; ComponentLink3Description: http://www.ecsxtal.com/store/pdf/ecx-53r.pdf?src-supplier=Digi-Key